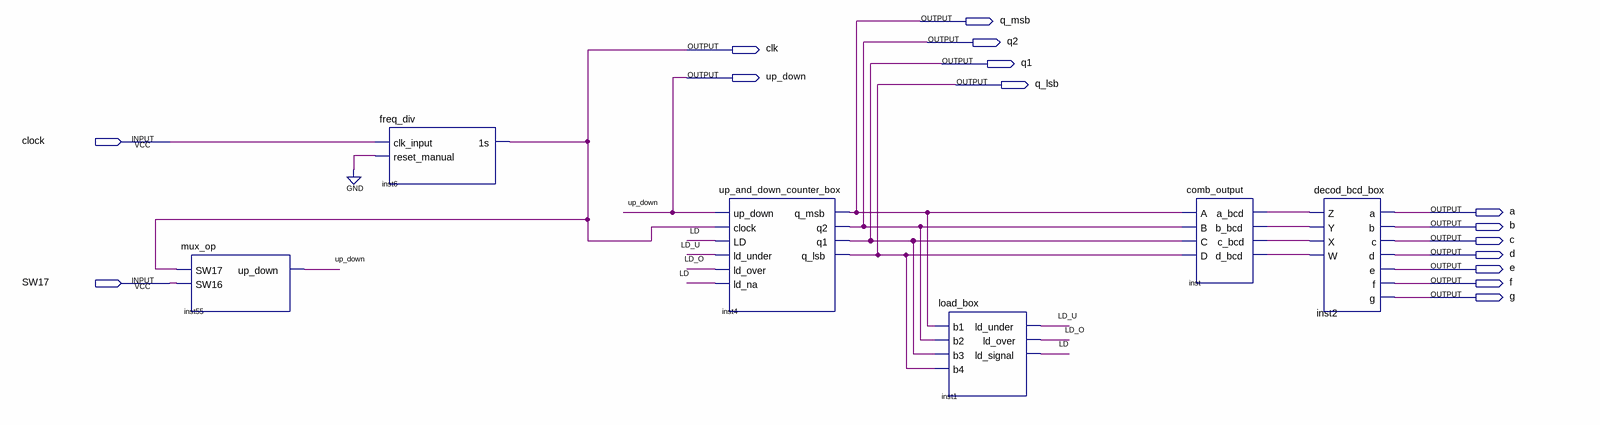
[diagram p0: schematic sheet]
// Quartus schematic up_and_down_counter.bdf as structural Verilog: 6 symbols, 15 pins
module up_and_down_counter (
  input  clock,
  input  SW17,
  output q_msb,
  output q2,
  output clk,
  output q1,
  output up_down,
  output q_lsb,
  output a,
  output b,
  output c,
  output d,
  output e,
  output f,
  output g
);

  wire inst_a_bcd, inst_b_bcd, inst_c_bcd, inst_d_bcd, LD, LD_O, LD_U;

  mux_op inst55 (.SW17(clk), .SW16(SW17), .up_down(up_down));
  freq_div inst6 (.clk_input(clock), .reset_manual(1'b0), .\1s (clk));
  up_and_down_counter_box inst4 (
    .up_down(up_down), .clock(clk), .LD(LD), .ld_under(LD_U), .ld_over(LD_O), .ld_na(LD), .q_msb(q_msb),
    .q2(q2), .q1(q1), .q_lsb(q_lsb));
  load_box inst1 (.b1(q_msb), .b2(q2), .b3(q1), .b4(q_lsb), .ld_under(LD_U), .ld_over(LD_O), .ld_signal(LD));
  comb_output inst (
    .A(q_msb), .B(q2), .C(q1), .D(q_lsb), .a_bcd(inst_a_bcd), .b_bcd(inst_b_bcd), .c_bcd(inst_c_bcd),
    .d_bcd(inst_d_bcd));
  decod_bcd_box inst2 (
    .Z(inst_a_bcd), .Y(inst_b_bcd), .X(inst_c_bcd), .W(inst_d_bcd), .a(a), .b(b), .c(c), .d(d), .e(e), .f(f),
    .g(g));
endmodule
